# EAGLE design Driver (EAGLE 9.1.3)
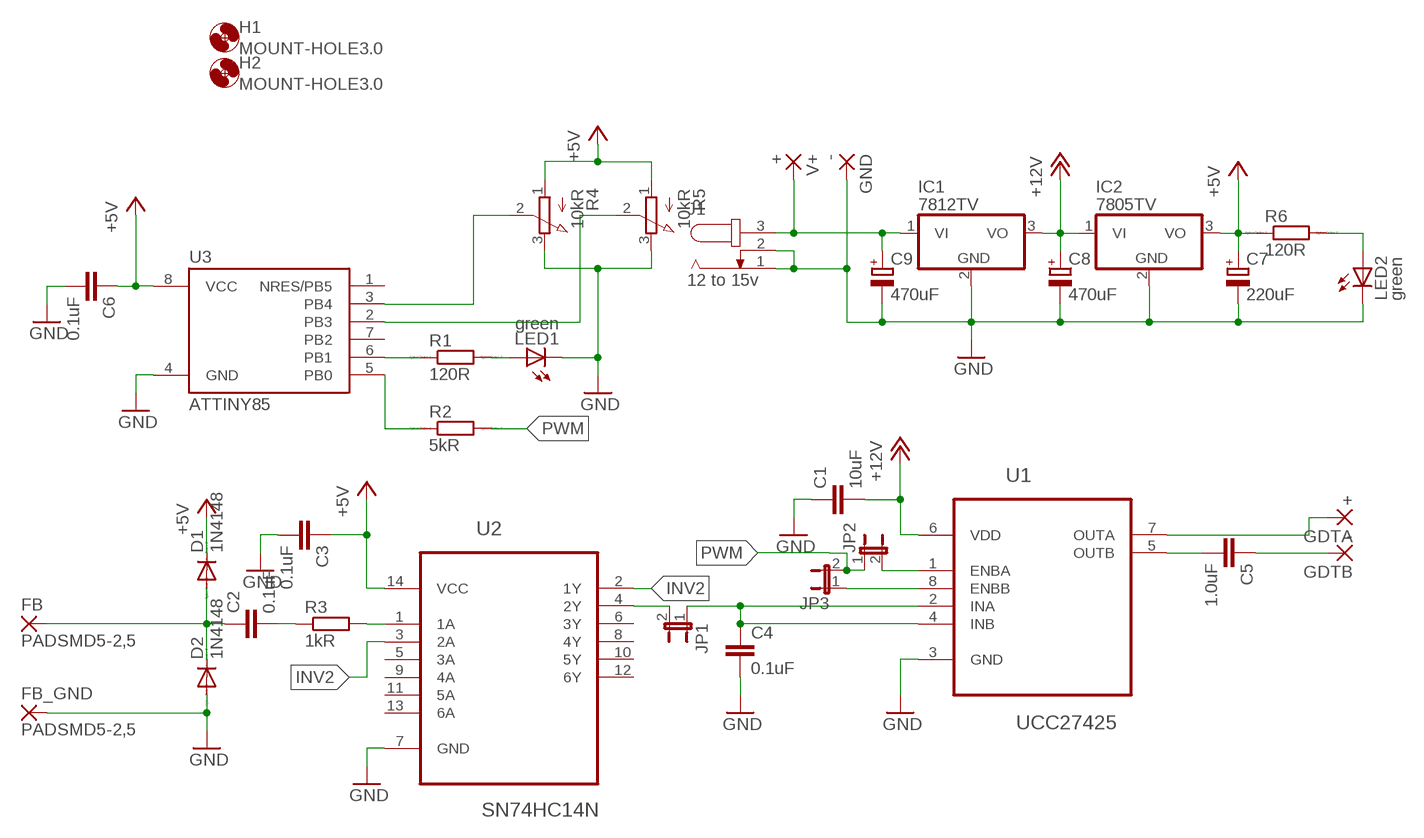
[diagram p0: schematic, sheet 1]

## Parts
C1  10uF  10UF-1210-50V-20%  [1210]
C2  0.1uF  C-EUC0805  [C0805]
C3  0.1uF  C-EUC0805  [C0805]
C4  0.1uF  C-EUC0805  [C0805]
C5  1.0uF  1.0UF-0805-25V-10%  [0805]
C6  0.1uF  C-EUC0805  [C0805]
C7  220uF  CPOL-EUE3.5-8  [E3,5-8]
C8  470uF  CPOL-EUE3.5-10  [E3,5-10]
C9  470uF  CPOL-EUE3.5-10  [E3,5-10]
D1  1N4148  1N4148DO35-7  [DO35-7]
D2  1N4148  1N4148DO35-7  [DO35-7]
FB  PADSMD5-2,5  WIREPADSMD5-2,5  [5-2,5]
FB_GND  PADSMD5-2,5  WIREPADSMD5-2,5  [5-2,5]
GDTA  +  WIREPAD4,16O1,6  [4,16O1,6]
GDTB  -  WIREPAD4,16O1,6  [4,16O1,6]
GND  -  WIREPAD4,16O1,6  [4,16O1,6]
H1  MOUNT-HOLE3.0  [3,0]
H2  MOUNT-HOLE3.0  [3,0]
IC1  7812TV  [TO220V]
IC2  7805TV  [TO220V]
J1  12 to 15v  JACK-PLUG1  [SPC4078]
JP1  JP1E  [JP1]
JP2  JP1E  [JP1]
JP3  JP1E  [JP1]
LED1  green  LEDCHIPLED_0805  [CHIPLED_0805]
LED2  green  LEDCHIPLED_0805  [CHIPLED_0805]
R1  120R  R  [R0805]
R2  5kR  R  [R0805]
R3  1kR  R-EU_R0805  [R0805]
R4  10kR  3RP/1610N  [3RP/1610N]
R5  10kR  3RP/1610N  [3RP/1610N]
R6  120R  R  [R0805]
U1  UCC27425  UCC27425QDRQ1DIP_8  [DIP254P762X419-8]
U2  SN74HC14N  [DIP254P762X508-14]
U3  ATTINY85  ATTINY85DIL  [DIL08]
V+  +  WIREPAD4,16O1,6  [4,16O1,6]

## Nets
+5V: C3.1 C6.1 C7.+ D1.C IC2.3(VO) R4.1(A) R5.1(A) R6.1 U2.14(VCC) U3.8(VCC)
+12V: C1.2 C8.+ IC1.3(VO) IC2.1(VI) U1.6(VDD)
GDTA: GDTA.1(P) U1.7(OUTA)
GDTB: C5.1 GDTB.1(P)
GND: C1.1 C3.2 C4.2 C6.2 C7.- C8.- C9.- D2.A FB_GND.1(P) GND.1(P) IC1.2(GND) IC2.2(GND) J1.1 J1.2 LED1.C LED2.C R4.3(E) R5.3(E) U1.3(GND) U2.7(GND) U3.4(GND)
INV2: U2.2(1Y) U2.3(2A)
N$1: R3.2 U2.1(1A)
N$2: C2.2 R3.1
N$3: C2.1 D1.A D2.C FB.1(P)
N$4: C4.1 JP1.1 U1.2(INA) U1.4(INB)
N$5: R1.1 U3.6(PB1)
N$6: LED1.A R1.2
N$7: C5.2 U1.5(OUTB)
N$8: R4.2(S) U3.3(PB4)
N$9: R5.2(S) U3.2(PB3)
N$10: R2.1 U3.5(PB0)
N$11: LED2.A R6.2
N$12: JP2.2 U1.1(ENBA)
N$13: C9.+ IC1.1(VI) J1.3 V+.1(P)
N$14: JP1.2 U2.4(2Y)
N$16: JP3.1 U1.8(ENBB)
PWM: JP2.1 JP3.2 R2.2
Unconnected: U2.5(3A) U2.6(3Y) U2.8(4Y) U2.9(4A) U2.10(5Y) U2.11(5A) U2.12(6Y) U2.13(6A) U3.1(NRES/PB5) U3.7(PB2)

## Library data of the parts
C1 = SparkFun-Capacitors:10UF: 10.0µF ceramic capacitors A capacitor is a passive two-terminal electrical component used to store electrical energy temporarily in an electric field.; PROD_ID: CAP-09824
C2-C4 C6 = resistor:C-EU: CAPACITOR, European symbol
C5 = SparkFun-Capacitors:1.0UF: 1µF ceramic capacitors A capacitor is a passive two-terminal electrical component used to store electrical energy temporarily in an electric field.; PROD_ID: CAP-08064
C7-C9 = resistor:CPOL-EU: POLARIZED CAPACITOR, European symbol
D1 D2 = diode:1N4148: DIODE high speed (Philips)
FB FB_GND GDTA GDTB GND V+ = wirepad:WIREPAD: Wire PAD connect wire on PCB
H1 H2 = holes:MOUNT-HOLE: MOUNTING HOLE with drill center marker
IC1 IC2 = linear:78*: Positive VOLTAGE REGULATOR Source: http://cache.national.com/ds/LM/LM78L05.pdf http://www.fairchildsemi.com/ds/LM/LM7805.pdf
J1 = con-jack:JACK-PLUG: DC POWER JACK Power Jack, DC, Right Angle, Through Hole, Rated 5A at 16VDC, PC Terminals Distributor: Farnell (www.Farnell.de) Drawing: 84N1161.pdf / 84N1162.pdf Manufacturer: SPC Technology (www.spctechnology.com) Type: SPC4077 / SPC 4078; OC_FARNELL: unknown; OC_NEWARK: unknown
JP1-JP3 = jumper:JP1E: JUMPER
LED1 LED2 = led:LED: LED OSRAM: - CHIPLED LG R971, LG N971, LY N971, LG Q971, LY Q971, LO R971, LY R971 LH N974, LH R974 LS Q976, LO Q976, LY Q976 LO Q996 - Hyper CHIPLED LW Q18S LB Q993, LB Q99A, LB R99A - SideLED LS A670, LO A670, LY A670, LG A670, LP A670 LB A673, LV A673, LT A673, LW A673 LH A674 LY A675 LS A676, LA A676, LO A676, LY A676, LW A676 LS A679, LY A679, LG A679 - Hyper Micro SIDELED® LS Y876, LA Y876, LO Y876, LY Y876 LT Y87S - SmartLED LW L88C, LW L88S LB L89C, LB L89S, LG L890 LS L89K, LO L89K, LY L89K LS L896, LA L896, LO L896, LY L896 - TOPLED LS T670, LO T670, LY T670, LG T670, LP T670 LSG T670, LSP T670, LSY T670, LOP T670, LYG T670 LG T671, LOG T671, LSG T671 LB T673, LV T673, LT T673, LW T673 LH T674 LS T676, LA T676, LO T676, LY T676, LB T676, LH T676, LSB T676, LW T676 LB T67C, LV T67C, LT T67C, LS T67K, LO T67K, LY T67K, LW E67C LS E67B, LA E67B, LO E67B, LY E67B, LB E67C, LV E67C, LT E67C LW T67C LS T679, LY T679, LG T679 LS T770, LO T770, LY T770, LG T770, LP T770 LB T773, LV T773, LT T773, LW T773 LH T774 LS E675, LA E675, LY E675, LS T675 LS T776, LA T776, LO T776, LY T776, LB T776 LHGB T686 LT T68C, LB T68C - Hyper Mini TOPLED® LB M676 - Mini TOPLED Santana® LG M470 LS M47K, LO M47K, LY M47K Source: http://www.osram.convergy.de LUXEON: - LUMILED® LXK2-PW12-R00, LXK2-PW12-S00, LXK2-PW14-U00, LXK2-PW14-V00 LXK2-PM12-R00, LXK2-PM12-S00, LXK2-PM14-U00 LXK2-PE12-Q00, LXK2-PE12-R00, LXK2-PE12-S00, LXK2-PE14-T00, LXK2-PE14-U00 LXK2-PB12-K00, LXK2-PB12-L00, LXK2-PB12-M00, LXK2-PB14-N00, LXK2-PB14-P00, LXK2-PB14-Q00 LXK2-PR12-L00, LXK2-PR12-M00, LXK2-PR14-Q00, LXK2-PR14-R00 LXK2-PD12-Q00, LXK2-PD12-R00, LXK2-PD12-S00 LXK2-PH12-R00, LXK2-PH12-S00 LXK2-PL12-P00, LXK2-PL12-Q00, LXK2-PL12-R00 Source: www.luxeon.com KINGBRIGHT: KA-3528ASYC Source: www.kingbright.com
R1 R2 R6 = eagle-ltspice:R: RESISTOR, European symbol; SPICEMODEL: NONE; SPICEPREFIX: R
R3 = resistor:R-EU_: RESISTOR, European symbol
R4 R5 = pot:3RP/1610N: 16mm Potentiometer one level Source: http://www.alphapotentiometers.net/html/16mm_pot_2.html
U1 = Texas Instruments_By_element14_Batch_1:UCC27425QDRQ1: DUAL 4-A HIGH-SPEED LOW-SIDE MOSFET DRIVERS WITH ENABLE
U2 = Texas Instruments_By_element14_Batch_1:SN74HC14N: HEX SCHMITT-TRIGGER INVERTERS; MPN: SN74HC14N; OC_FARNELL: 9591125; OC_NEWARK: 60K6826; PACKAGE: DIP-14; SUPPLIER: Texas Instruments
U3 = attiny85:ATTINY85: ATMEL ATtiny 85

## Net classes
0 default: clearance 0.5 mm

## Board
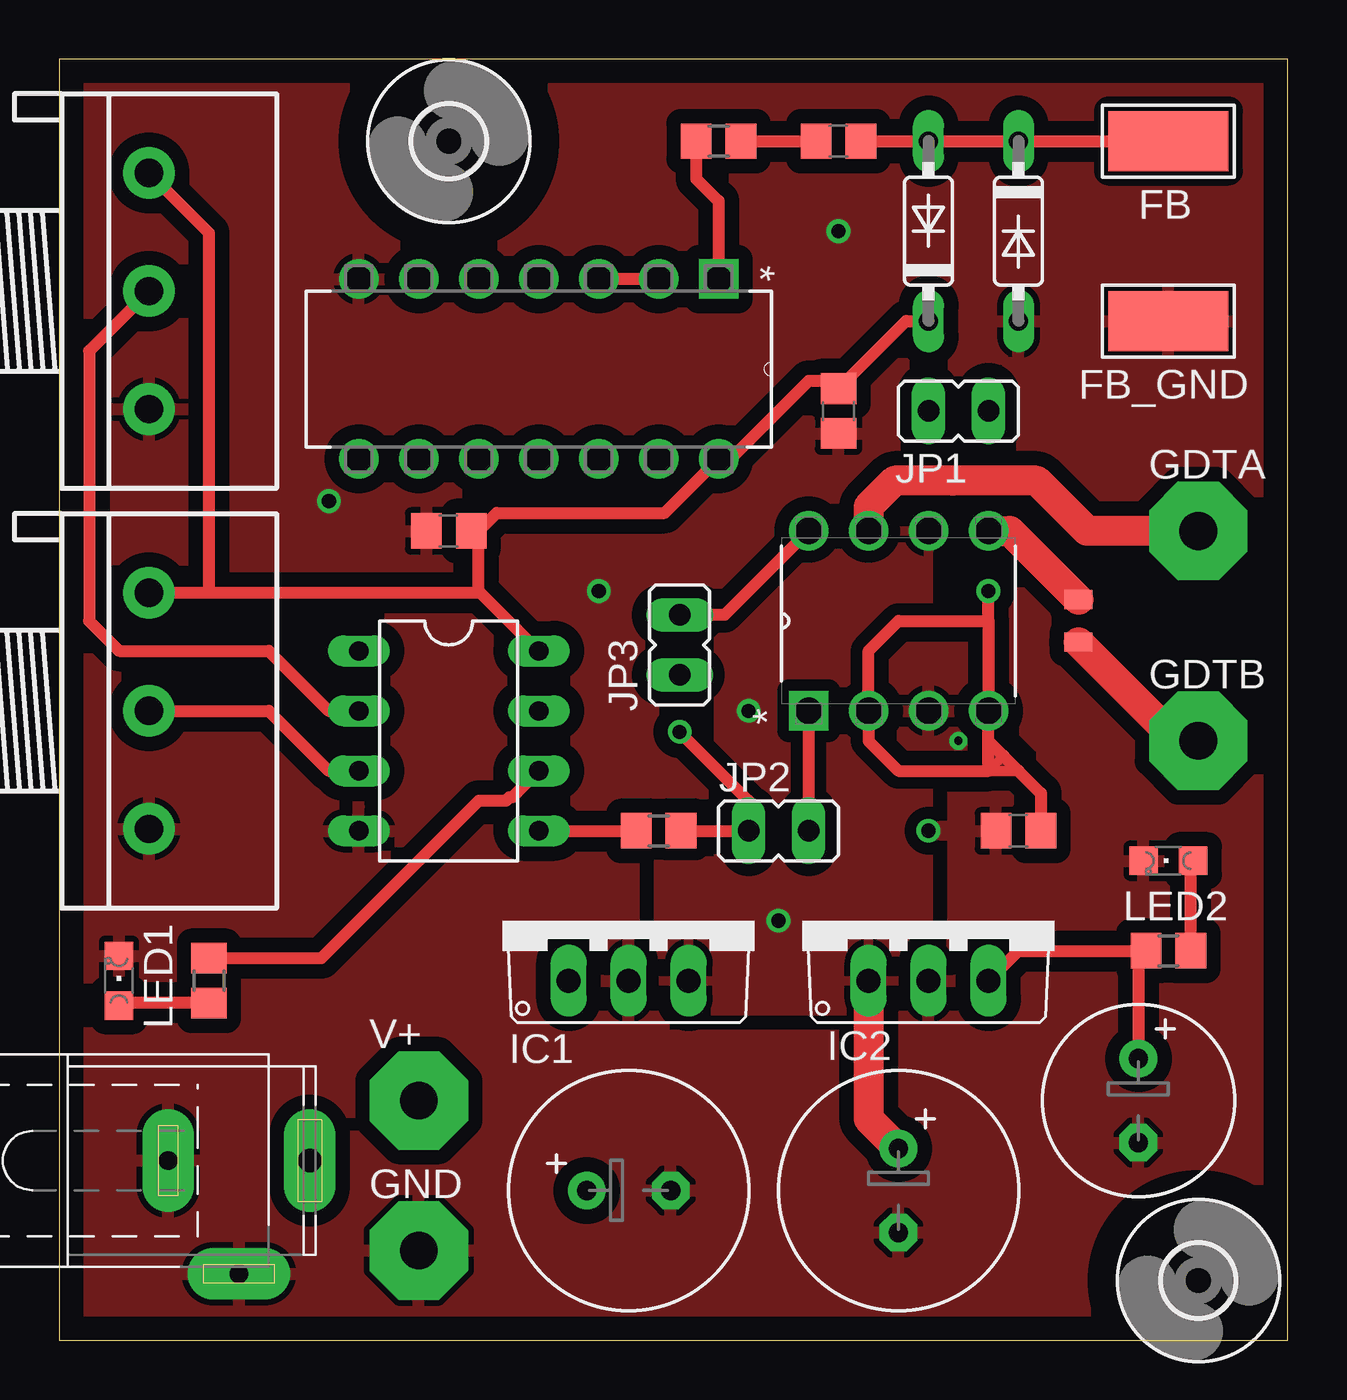
[diagram p1: board, top side]
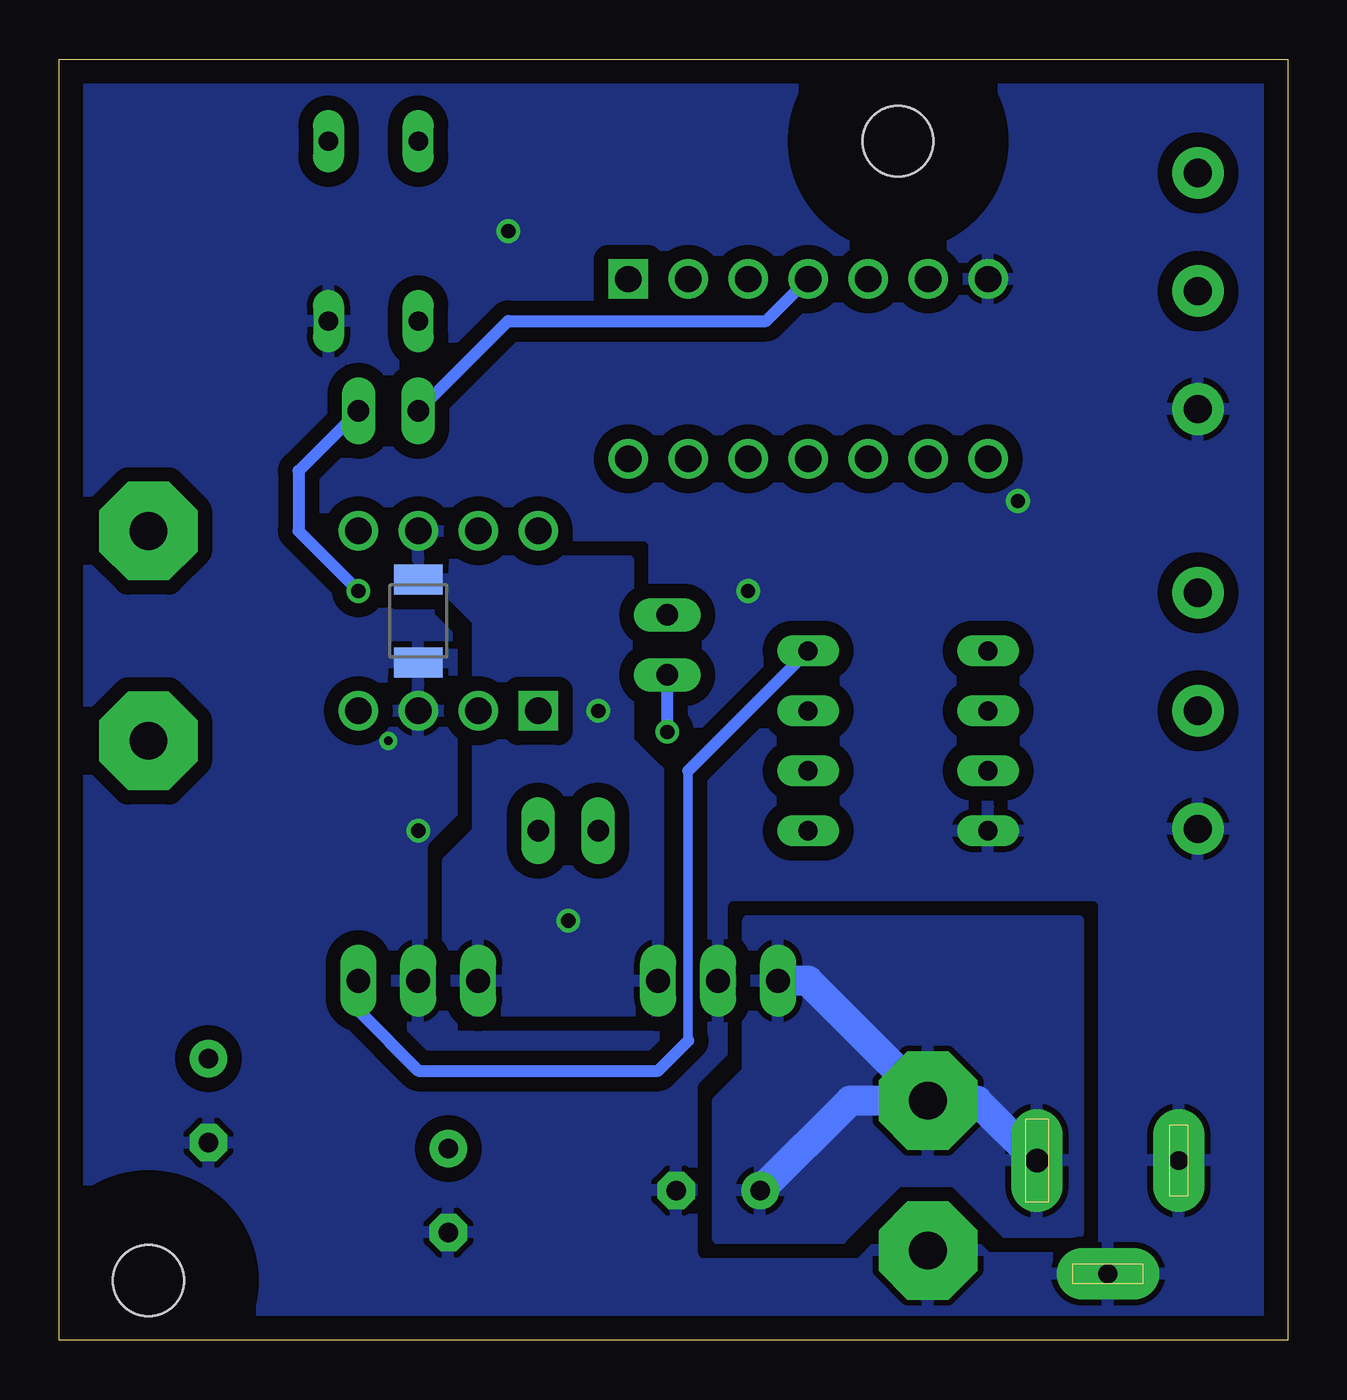
[diagram p2: board, bottom side, seen from below]

Size 52.05 x 54.28 mm. Coordinates in mm from the lower left corner, seen from the top.
Outline: 0,0 52.05,0 52.05,54.28 0,54.28 0,0
Copper layers (1*16): Top 0.035mm / dielectric 1.5mm / Bottom 0.035mm
Design rules "default": minimum track width 6mil, minimum drill 0.35mm, track to track 6mil, track to pad 6mil, pad to pad 6mil, via to via 6mil, smd to smd 6mil, copper to edge 40mil, drill to drill 6mil, minimum pad ring 10mil, minimum via ring 8mil, stop-mask expansion 4mil, vias tented up to drill 0mil, thermal gap 10mil

### Footprints (pad centres in the part's own frame; a part is rotated, then mirrored left to right if it is on the bottom)
1210 = smd 1.27 x 2.06: 1 -1.755,0; 2 1.755,0
C0805 = smd 1.3 x 1.5: 1 -0.95,0; 2 0.95,0
0805 = smd 0.8 x 1.2: 1 -0.9,0; 2 0.9,0
E3,5-8 = drill 0.813 pad 1.6: + -1.778,0 | drill 0.813 pad 1.6 octagon: - 1.778,0
E3,5-10 = drill 0.813 pad 1.6: + -1.778,0 | drill 0.813 pad 1.6 octagon: - 1.778,0
DO35-7 = drill 0.813 long: A 3.81,0; C -3.81,0
5-2,5 = smd 2.54 x 5.08: 1 0,0
4,16O1,6 = drill 1.6 pad 4.166 octagon: 1 0,0
3,0 = hole 3: 0,0
TO220V = drill 1.016 long: 1 -2.54,-2.54; 2 0,-2.54; 3 2.54,-2.54
SPC4078 = drill 0.8 pad 2.184 long: 1 -3,0; 2 0,-4.8 | drill 1 pad 2.184 long: 3 3,0
JP1 = drill 0.914 long: 1 0,-1.27; 2 0,1.27
CHIPLED_0805 = smd 1.2 x 1.2: A 0,-1.05; C 0,1.05
R0805 = smd 1.3 x 1.5: 1 -0.95,0; 2 0.95,0
3RP/1610N = drill 1.2 pad 2.184: 1 -5,0; 2 0,0; 3 5,0
DIP254P762X419-8 = drill 1.118 square: 1 -7.62,7.62 | drill 1.118: 2 -7.62,5.08; 3 -7.62,2.54; 4 -7.62,0; 5 0,0; 6 0,2.54; 7 0,5.08; 8 0,7.62
DIP254P762X508-14 = drill 1.118 square: 1 -7.62,15.24 | drill 1.118: 2 -7.62,12.7; 3 -7.62,10.16; 4 -7.62,7.62; 5 -7.62,5.08; 6 -7.62,2.54; 7 -7.62,0; 8 0,0; 9 0,2.54; 10 0,5.08; 11 0,7.62; 12 0,10.16; 13 0,12.7; 14 0,15.24
DIL08 = drill 0.813 long: 1 -3.81,-3.81; 2 -1.27,-3.81; 3 1.27,-3.81; 4 3.81,-3.81; 5 3.81,3.81; 6 1.27,3.81; 7 -1.27,3.81; 8 -3.81,3.81

### Placement (x,y rotation side)
C1  36.83,30.48 90 bottom
C2  33.02,50.8 180 top
C3  33.02,39.37 270 top
C4  40.64,21.59 180 top
C5  43.18,30.48 90 top
C6  16.51,34.29 180 top
C7  45.72,10.16 270 top
C8  35.56,6.35 270 top
C9  24.13,6.35 0 top
D1  36.83,46.99 90 top
D2  40.64,46.99 270 top
FB  46.99,50.8 270 top
FB_GND  46.99,43.18 270 top
GDTA  48.26,34.29 0 top
GDTB  48.26,25.4 0 top
GND  15.24,3.81 0 top
H1  16.51,50.8 0 top
H2  48.26,2.54 0 top
IC1  24.13,17.78 0 top
IC2  36.83,17.78 0 top
J1  7.62,7.62 0 top
JP1  38.1,39.37 90 top
JP2  30.48,21.59 270 top
JP3  26.29,29.46 180 top
LED1  2.54,15.24 0 top
LED2  46.99,20.32 90 top
R1  6.35,15.24 270 top
R2  25.4,21.59 0 top
R3  27.94,50.8 180 top
R4  3.81,26.67 270 top
R5  3.81,44.45 270 top
R6  46.99,16.51 0 top
U1  39.37,34.29 90 top
U2  12.7,37.34 270 top
U3  16.51,25.4 270 top
V+  15.24,10.16 0 top

### Tracks (layer width: path | path; a pad name or v marks a point on that pad's centre or on a via)
+5V
  Top 0.508: U3.8 17.78,31.75 | 17.78,31.75 17.78,34.29 | 17.78,34.29 18.54,35.05 25.65,35.05 U2.14 28.45,37.34 31.75,40.64 32.7,40.64 C3.1 35.88,43.18 D1.C | 17.78,31.75 17.7,31.67 7.62,31.67 | 7.62,31.67 6.35,31.67 | 6.35,31.67 R4.1 | 7.62,31.67 | 6.35,31.67 6.35,46.91 R5.1 | C7.+ 45.72,16.19 R6.1 40.64,16.51 IC2.3 | C6.1 17.78,34.29
  Bottom 0.406: 25.4,12.7 25.4,24.13
  Bottom 0.508: 25.4,12.7 26.67,11.43 36.83,11.43 39.37,13.97 IC2.3 | 25.4,24.13 U3.8
+12V  (via drill 0.6)
  Top 1.27: IC2.1 34.29,9.4 C8.+
  other vias: 30.48,17.78 29.21,26.67
  pour Bottom (isolate 0.61): 26.67,13.97 35.56,13.97 35.56,20.32 34.29,21.59 34.29,22.86 34.29,30.48 36.83,33.02 36.83,34.29 35.56,34.29 35.56,33.02 27.94,33.02 27.94,25.4 26.67,24.13
  pour Top: 35.56,13.97 27.94,13.97 25.4,13.97 25.4,20.32 27.94,20.32 27.94,30.48 30.48,33.02 30.48,34.29 36.83,34.29 36.83,33.02 36.83,17.78 35.56,16.51
GDTA
  Top 1.27: GDTA.1 43.55,34.29 41.42,36.42 37.85,36.42 35.4,36.42 34.29,35.32 U1.7
GDTB
  Top 1.27: C5.1 47.36,25.4 GDTB.1
GND  (via drill 0.35, 0.6)
  other vias: 38.1,25.4 11.43,35.56 36.83,21.59 22.86,31.75 33.02,46.99
  pour Bottom (isolate 0.61, rank 2): -2.54,-1.27 57.15,-1.27 57.15,58.42 -2.54,58.42
  pour Top (isolate 0.61, rank 2): -2.54,55.88 -2.54,0 -1.27,-1.27 53.34,-1.27 55.88,1.27 55.88,54.61 53.34,57.15 -1.27,57.15
INV2
  Top 0.508: U2.2 U2.3
N$1
  Top 0.508: U2.1 27.94,48.26 26.99,49.21 R3.2
N$2
  Top 0.508: R3.1 C2.2
N$3
  Top 0.508: C2.1 36.51,50.8 D1.A D2.C 45.72,50.8 FB.1
N$4  (via drill 0.6)
  Top 0.406: 40.64,24.13 39.37,24.13 40.01,24.77
  Top 0.508: 39.37,25.4 U1.4 39.37,30.48 | 39.37,25.4 40.01,24.77 40.64,24.13 41.59,23.18 C4.1 | 39.37,30.48 35.56,30.48 34.29,29.21 U1.2 34.29,25.4 35.56,24.13 39.37,24.13 39.37,25.4 | 39.37,30.48 v39.37,31.75
  Bottom 0.508: JP1.1 41.91,36.83 41.91,34.29 v39.37,31.75
  pour Top: 39.37,25.4 40.64,24.13 39.37,24.13
N$5
  Top 0.508: U3.6 19.19,23 19.07,23 18.93,22.86 17.78,22.86 11.11,16.19 R1.1
N$6
  Top 0.254: 2.64,14.29 LED1.A
  Top 0.508: R1.2 2.64,14.29
N$7
  Top 1.27: U1.5 40.27,34.29 C5.2
N$8
  Top 0.508: R4.2 8.89,26.67 11.43,24.13 U3.3
N$9
  Top 0.508: R5.2 1.27,41.91 1.27,30.48 2.54,29.21 8.89,29.21 11.43,26.67 U3.2
N$10
  Top 0.508: U3.5 R2.1
N$11
  Top 0.254: 47.94,20.22 LED2.A
  Top 0.508: R6.2 47.94,20.22
N$12
  Top 0.508: U1.1 JP2.2
N$13
  Bottom 1.27: J1.3 13.16,10.16 V+.1 | V+.1 18.54,10.16 C9.+ | V+.1 20.32,15.24 IC1.1
  pour Bottom (isolate 0.61): 8.89,10.16 8.89,5.08 12.32,5.08 14.22,6.99 16.38,6.99 16.51,6.86 18.29,5.08 19.05,5.08 24.13,5.08 24.13,10.16 22.86,11.43 22.86,17.78 8.89,17.78
  pour Bottom: 8.89,5.08 8.89,4.57 11.94,4.57 14.1,6.73 16.51,6.73 18.92,4.32 24.13,4.32 24.13,8.13 24,8.26 12.06,8.26
N$14
  Bottom 0.508: U2.4 22.1,43.18 33.02,43.18 JP1.2
N$16
  Top 0.508: U1.8 28.19,30.73 JP3.1
PWM  (via drill 0.6)
  Top 0.508: v26.29,25.78 29.21,22.86 JP2.1 R2.2
  Bottom 0.508: JP3.2 v26.29,25.78

### Text on the board
bValues: SSTC Driver from http://www.loneoceans.com/labs/sstc2/ / Board : MrMdudu https://github.com/MrMdudu/EAGLE.git